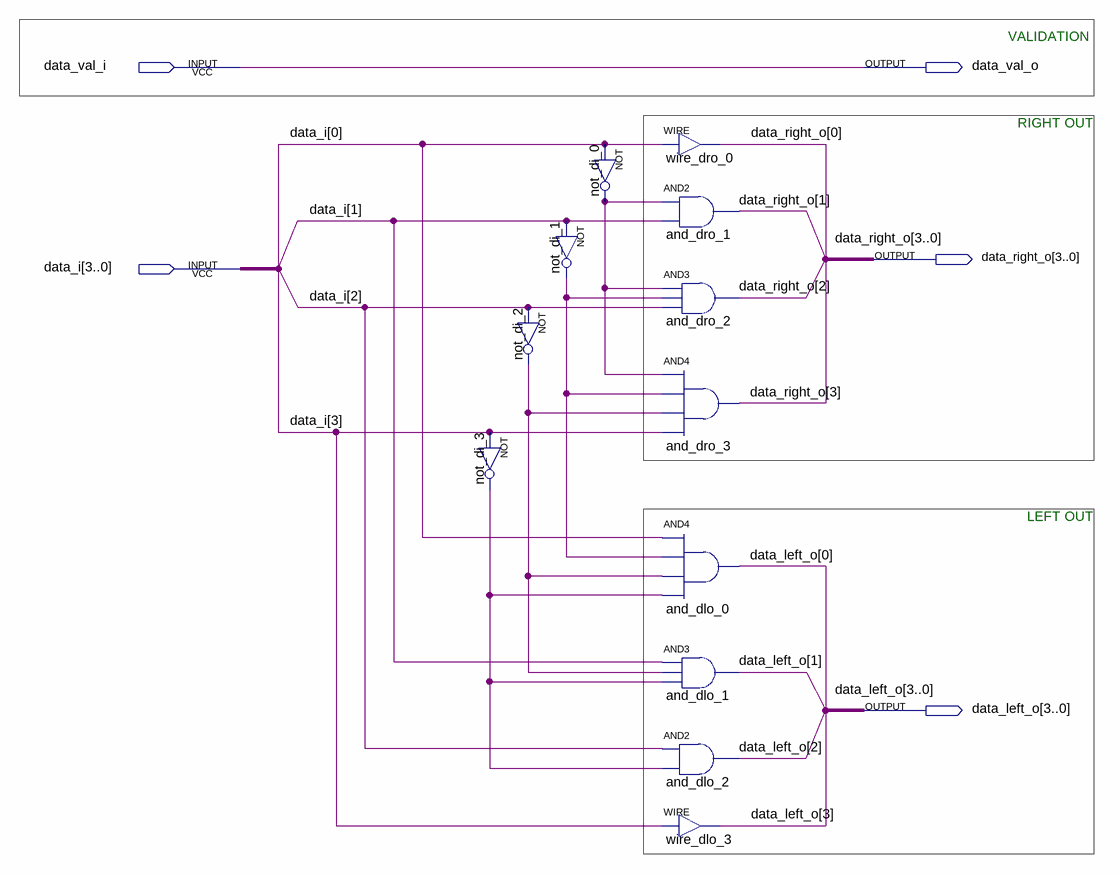
[diagram p0: schematic sheet]
// Quartus schematic priority_encoder_4.bdf as structural Verilog: 12 symbols, 5 pins
module priority_encoder_4 (
  input  data_val_i,
  input  [3:0] data_i,
  output data_val_o,
  output [3:0] data_right_o,
  output [3:0] data_left_o
);

  wire not_di_0_out, not_di_1_out, not_di_2_out, not_di_3_out;

  not not_di_3 (not_di_3_out, data_i[3]);
  not not_di_1 (not_di_1_out, data_i[1]);
  not not_di_2 (not_di_2_out, data_i[2]);
  not not_di_0 (not_di_0_out, data_i[0]);
  assign data_right_o[0] = data_i[0];  // WIRE wire_dro_0
  and and_dro_1 (data_right_o[1], not_di_0_out, data_i[1]);
  and and_dro_2 (data_right_o[2], not_di_0_out, not_di_1_out, data_i[2]);
  and and_dro_3 (data_right_o[3], not_di_0_out, not_di_1_out, not_di_2_out, data_i[3]);
  and and_dlo_0 (data_left_o[0], data_i[0], not_di_1_out, not_di_2_out, not_di_3_out);
  and and_dlo_1 (data_left_o[1], data_i[1], not_di_2_out, not_di_3_out);
  and and_dlo_2 (data_left_o[2], data_i[2], not_di_3_out);
  assign data_left_o[3] = data_i[3];  // WIRE wire_dlo_3

  assign data_val_o = data_val_i;

  // Notes on the sheet:
  //   VALIDATION
  //   RIGHT OUT
  //   LEFT OUT
endmodule
